# EAGLE design Bytes Turing Expander (EAGLE 6.5.0)
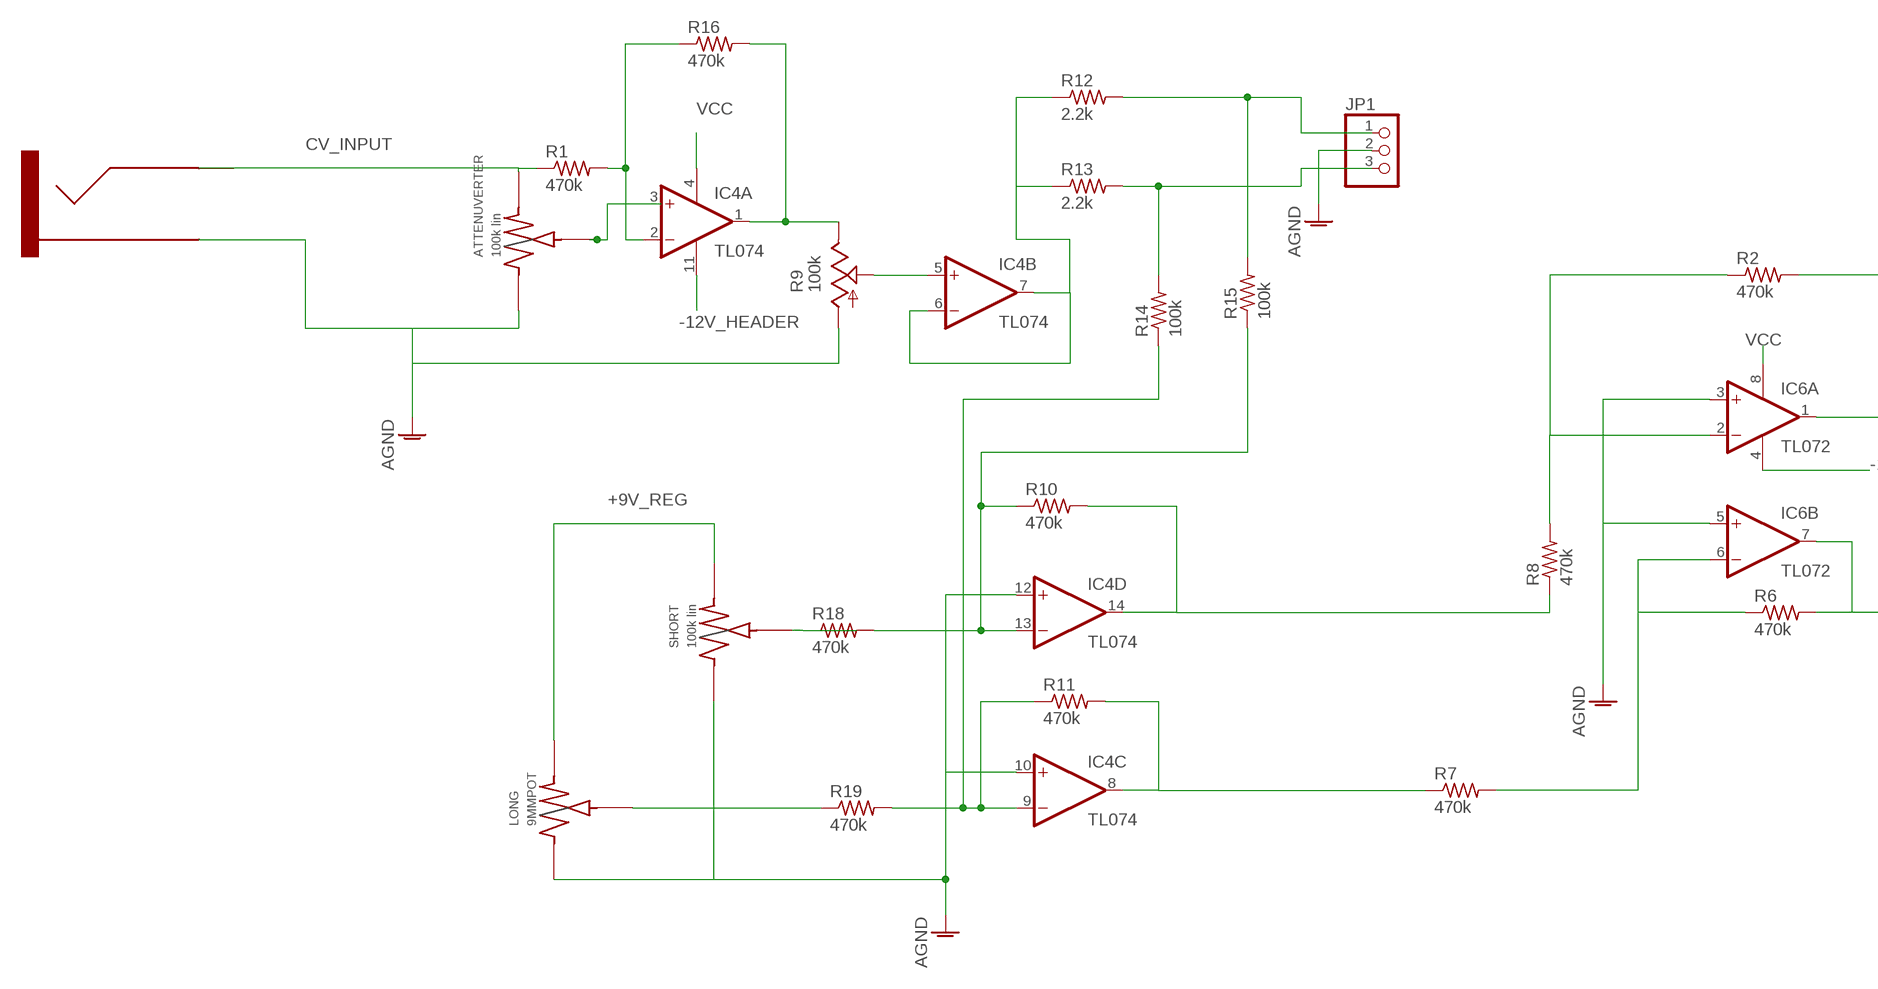
[diagram p0: schematic, sheet 1, part 1 of 2]
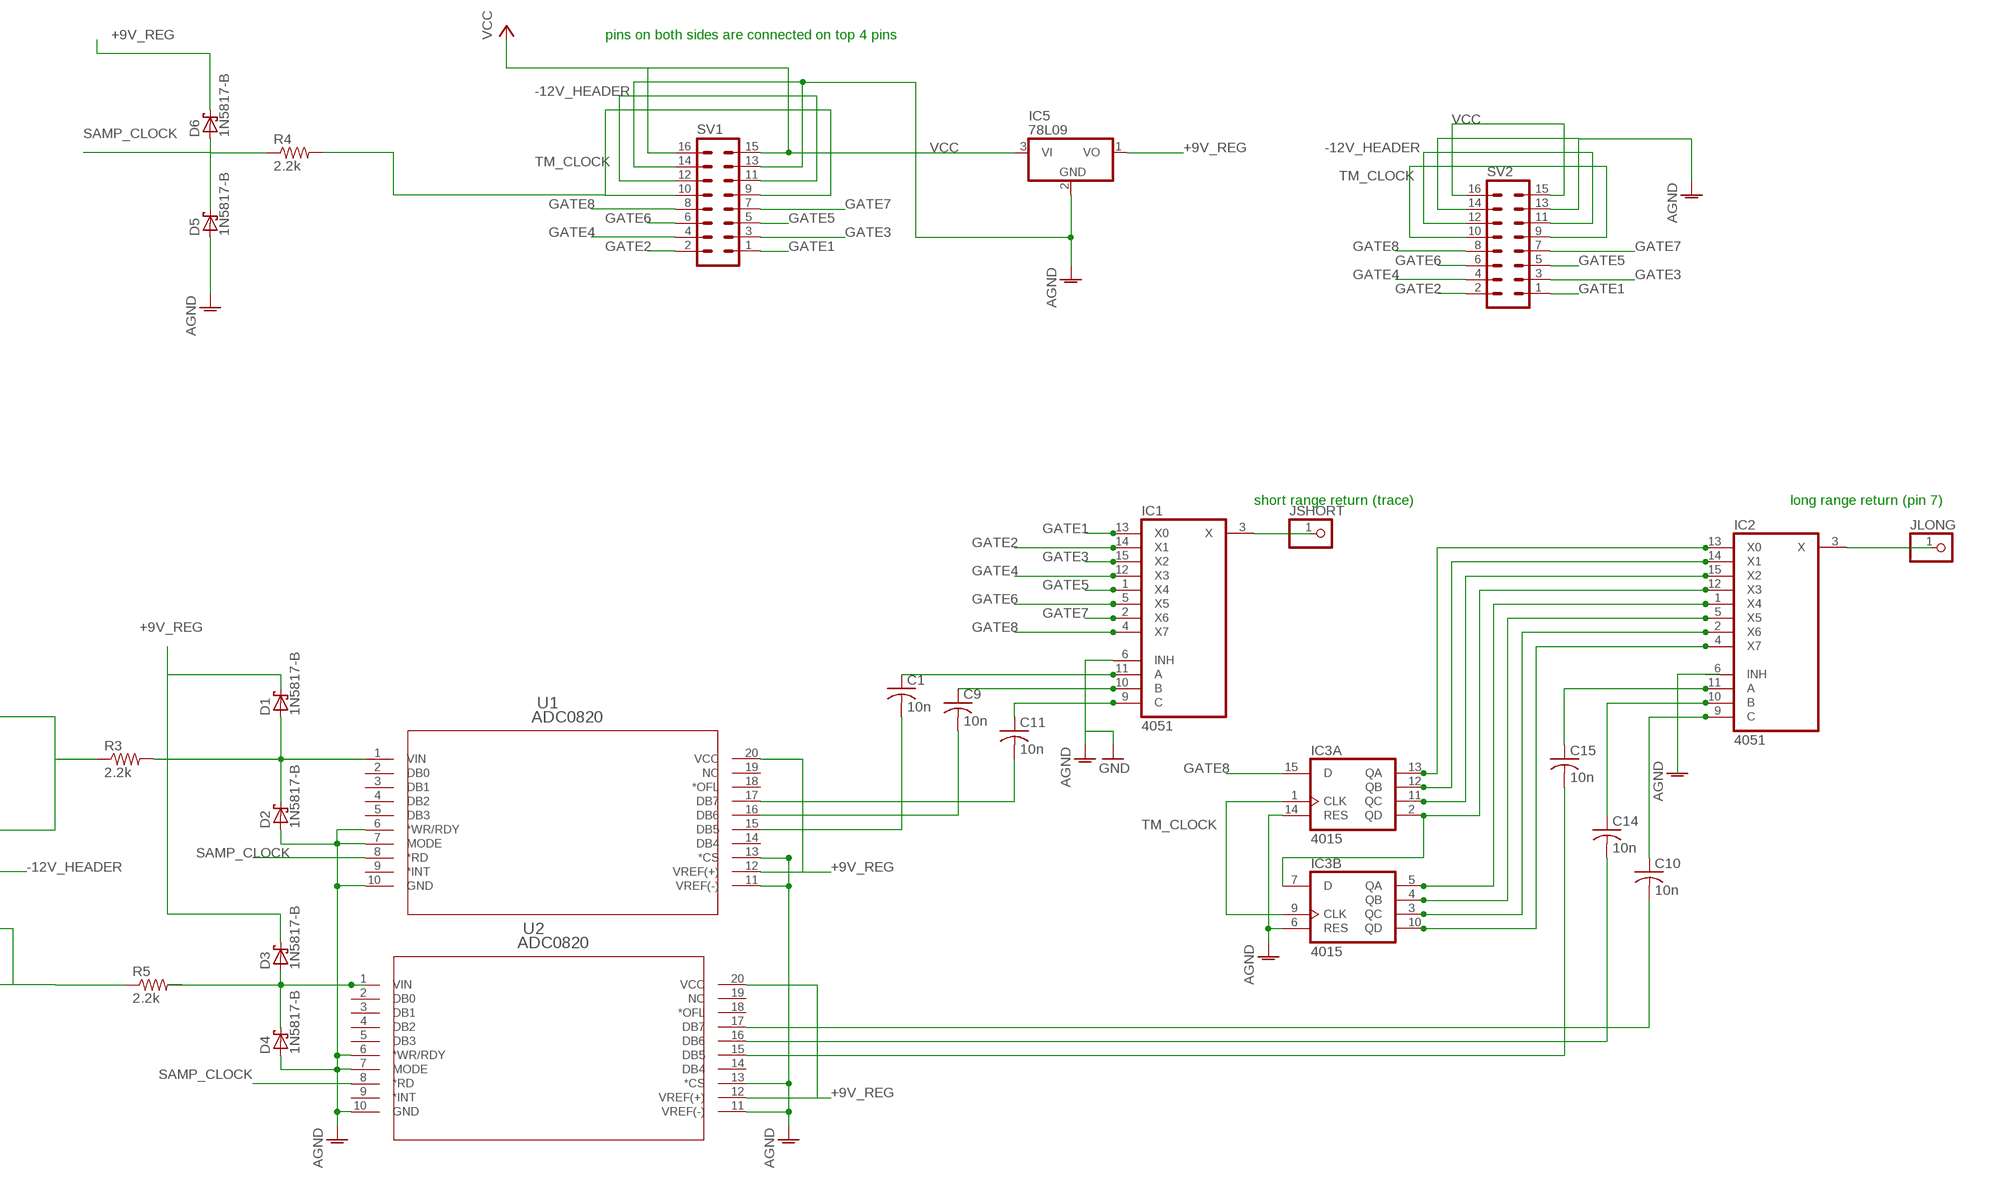
[diagram p1: schematic, sheet 1, part 2 of 2]

## Parts
ATTENUVERTER  100k lin  9MMPOT  [9MMPOT]
C1  10n  C-US025-024X044  [C025-024X044]
C9  10n  C-US025-024X044  [C025-024X044]
C10  10n  C-US025-024X044  [C025-024X044]
C11  10n  C-US025-024X044  [C025-024X044]
C14  10n  C-US025-024X044  [C025-024X044]
C15  10n  C-US025-024X044  [C025-024X044]
D1  1N5817-B  [DO41-7.6]
D2  1N5817-B  [DO41-7.6]
D3  1N5817-B  [DO41-7.6]
D4  1N5817-B  [DO41-7.6]
D5  1N5817-B  [DO41-7.6]
D6  1N5817-B  [DO41-7.6]
IC1  4051  4051N  [DIL16]
IC2  4051  4051N  [DIL16]
IC3  4015  4015N  [DIL16]
IC4  TL074  TL074P  [DIL14]
IC5  78L09  78L08Z  [TO92]
IC6  TL072  TL072P  [DIL08]
JLONG  PINHD-1X1  [1X01]
JP1  PINHD-1X3  [1X03]
JSHORT  PINHD-1X1  [1X01]
LONG  9MMPOT  [9MMPOT]
R1  470k  R-US_0204/2V  [0204V]
R2  470k  R-US_0204/2V  [0204V]
R3  2.2k  R-US_0204/2V  [0204V]
R4  2.2k  R-US_0204/2V  [0204V]
R5  2.2k  R-US_0204/2V  [0204V]
R6  470k  R-US_0204/2V  [0204V]
R7  470k  R-US_0204/2V  [0204V]
R8  470k  R-US_0204/2V  [0204V]
R9  100k  TRIM_US-B64Y  [B64Y]
R10  470k  R-US_0204/2V  [0204V]
R11  470k  R-US_0204/2V  [0204V]
R12  2.2k  R-US_0204/2V  [0204V]
R13  2.2k  R-US_0204/2V  [0204V]
R14  100k  R-US_0204/2V  [0204V]
R15  100k  R-US_0204/2V  [0204V]
R16  470k  R-US_0204/2V  [0204V]
R18  470k  R-US_0204/2V  [0204V]
R19  470k  R-US_0204/2V  [0204V]
SHORT  100k lin  9MMPOT  [9MMPOT]
SV1  MA08-2  [MA08-2]
SV2  MA08-2  [MA08-2]
U1  ADC0820  ADC0820-N_NFH_20  [NFH20]
U2  ADC0820  ADC0820-N_NFH_20  [NFH20]
U$1  3.5MMJACK  [3.5MMPHONEJACK]

## Nets
+9V_REG: D1.C D3.C D6.C IC5.1(VO) LONG.LEFT(RIGHT) SHORT.LEFT(RIGHT) U1.12(VREF(+)) U1.20(VCC) U2.12(VREF(+)) U2.20(VCC)
-12V_HEADER: IC4.11(P:V-) IC6.4(P:V-) SV1.11 SV1.12 SV2.11 SV2.12
AGND: ATTENUVERTER.RIGHT(LEFT) D2.A D4.A D5.A IC1.6(INH) IC3.6(B:RES) IC3.14(A:RES) IC4.10(C:+IN) IC4.12(D:+IN) IC5.2(GND) IC6.3(A:+IN) IC6.5(B:+IN) JP1.2 LONG.RIGHT(LEFT) R9.A SHORT.RIGHT(LEFT) SV1.13 SV1.14 SV2.13 SV2.14 U1.6(*WR/RDY) U1.7(MODE) U1.10(GND) U1.11(VREF(-)) U1.13(*CS) U2.6(*WR/RDY) U2.7(MODE) U2.10(GND) U2.11(VREF(-)) U2.13(*CS) U$1.SLEEVE ; supply symbol labelled GND
CV_INPUT: ATTENUVERTER.LEFT(RIGHT) R1.1 U$1.TIP
GATE1: IC1.13(X0) SV1.1 SV2.1
GATE2: IC1.14(X1) SV1.2 SV2.2
GATE3: IC1.15(X2) SV1.3 SV2.3
GATE4: IC1.12(X3) SV1.4 SV2.4
GATE5: IC1.1(X4) SV1.5 SV2.5
GATE6: IC1.5(X5) SV1.6 SV2.6
GATE7: IC1.2(X6) SV1.7 SV2.7
GATE8: IC1.4(X7) IC3.15(A:D) SV1.8 SV2.8
JSHORT: IC1.3(X) JSHORT.1
N$2: IC4.2(A:-IN) R1.2 R16.1
N$3: IC4.1(A:OUT) R9.E R16.2
N$4: LONG.CENTER R19.1
N$5: R18.1 SHORT.CENTER
N$6: IC4.6(B:-IN) IC4.7(B:OUT) R12.1 R13.1
N$7: IC4.5(B:+IN) R9.S
N$8: IC6.1(A:OUT) R2.2 R3.1
N$9: IC4.9(C:-IN) R11.1 R14.1 R19.2
N$10: IC2.12(X3) IC3.2(A:QD) IC3.7(B:D)
N$11: C11.1 IC1.9(C)
N$12: IC2.13(X0) IC3.13(A:QA)
N$13: IC2.14(X1) IC3.12(A:QB)
N$14: IC2.15(X2) IC3.11(A:QC)
N$15: IC2.1(X4) IC3.5(B:QA)
N$16: IC2.5(X5) IC3.4(B:QB)
N$17: IC2.2(X6) IC3.3(B:QC)
N$18: IC2.4(X7) IC3.10(B:QD)
N$19: IC4.14(D:OUT) R8.1 R10.2
N$20: IC6.7(B:OUT) R5.1 R6.2
N$21: IC4.8(C:OUT) R7.1 R11.2
N$22: JP1.3 R13.2 R14.2
N$23: C9.1 IC1.10(B)
N$24: C1.1 IC1.11(A)
N$25: C11.2 U1.17(DB7)
N$26: C9.2 U1.16(DB6)
N$27: C1.2 U1.15(DB5)
N$28: C10.1 IC2.9(C)
N$29: C15.1 IC2.11(A)
N$30: C14.1 IC2.10(B)
N$31: IC6.2(A:-IN) R2.1 R8.2
N$32: C15.2 U2.15(DB5)
N$33: C14.2 U2.16(DB6)
N$34: C10.2 U2.17(DB7)
N$35: JP1.1 R12.2 R15.2
N$36: ATTENUVERTER.CENTER IC4.3(A:+IN)
N$37: IC4.13(D:-IN) R10.1 R15.1 R18.2
N$39: IC6.6(B:-IN) R6.1 R7.2
N$47: IC2.3(X) JLONG.1
N$48: D3.A D4.C R5.2 U2.1(VIN)
N$49: D1.A D2.C R3.2 U1.1(VIN)
SAMP_CLOCK: D5.C D6.A R4.1 U1.8(*RD) U2.8(*RD)
TM_CLOCK: IC3.1(A:CLK) IC3.9(B:CLK) R4.2 SV1.9 SV1.10 SV2.9 SV2.10
VCC: IC4.4(P:V+) IC5.3(VI) IC6.8(P:V+) SV1.15 SV1.16 SV2.15 SV2.16
Unconnected: IC2.6(INH) U1.2(DB0) U1.3(DB1) U1.4(DB2) U1.5(DB3) U1.9(*INT) U1.14(DB4) U1.18(*OFL) U1.19(NC) U2.2(DB0) U2.3(DB1) U2.4(DB2) U2.5(DB3) U2.9(*INT) U2.14(DB4) U2.18(*OFL) U2.19(NC)

## Notes on the sheet
- pins on both sides are connected on top 4 pins
- short range return (trace) | long range return (pin 7)

## Power pins joined to a net without a drawn wire
AGND: IC1.7(VEE) IC1.8(GND) IC2.7(VEE) IC2.8(GND)
VCC: IC1.16(VCC) IC2.16(VCC) IC3.16(P:VDD)
VSS: IC3.8(P:VSS)

## Library data of the parts
ATTENUVERTER LONG SHORT = 9mmpot_modified:9MMPOT
C1 C9-C11 C14 C15 = resistor:C-US: CAPACITOR, American symbol
D1-D6 = diode:1N581*: 1.0A SCHOTTKY BARRIER RECTIFIER Source: http://www.diodes.com/datasheets/ds23001.pdf
IC1 IC2 = 40xx:4051: 8-channel ANALOG MULTIPLEXER
IC3 = 40xx:4015: Dual 4-bit static SHIFT REGISTER
IC4 = linear:TL074: OP AMP
IC5 = adafruit:78*: Positive VOLTAGE REGULATOR Added bigger pads to the TO-92 package
IC6 = linear:TL072: OP AMP
JLONG JSHORT = pinhead:PINHD-1X1: PIN HEADER
JP1 = adafruit:PINHD-1X3: PIN HEADER
R1-R8 R10-R16 R18 R19 = resistor:R-US_: RESISTOR, American symbol
R9 = pot:TRIM_US-: POTENTIOMETER
SV1 SV2 = con-lstb:MA08-2: PIN HEADER; OC_FARNELL: unknown; OC_NEWARK: unknown
U1 U2 = adc0820:ADC0820-N_NFH_20; MANUFACTURER_PART_NUMBER: adc0820_dw_20; VENDOR: Texas Instruments
U$1 = elipech_modified:3.5MMJACK

## Board
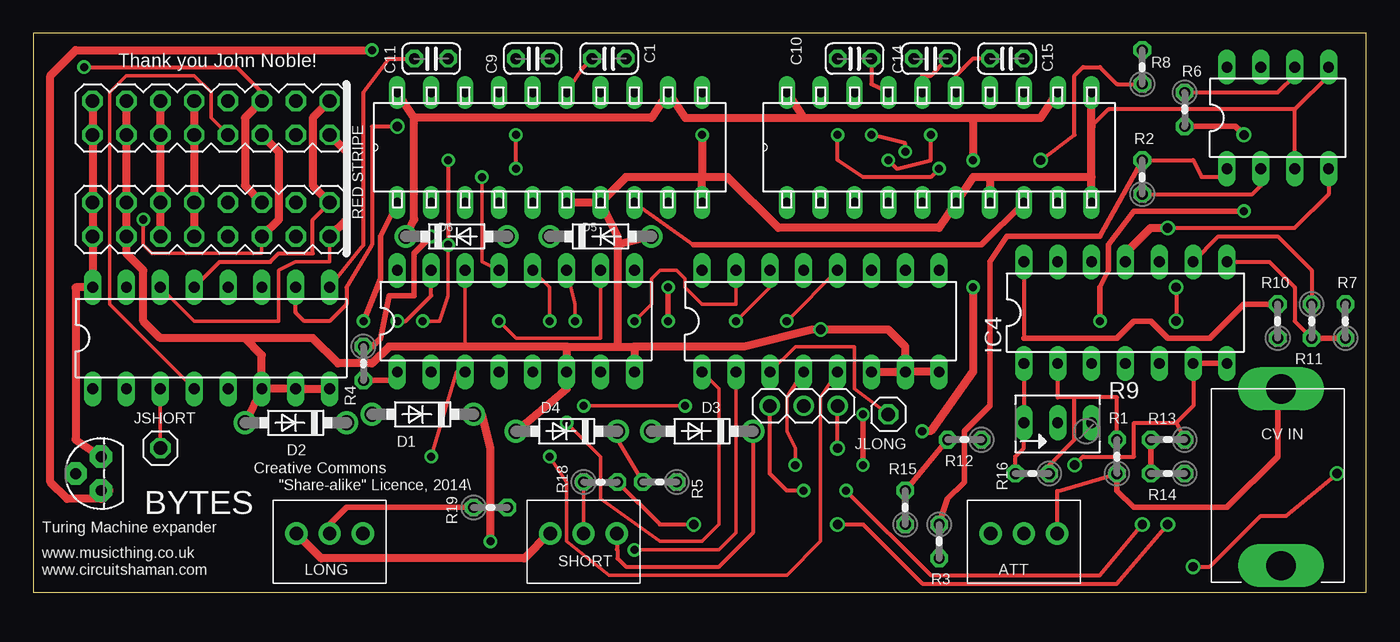
[diagram p2: board, top side]
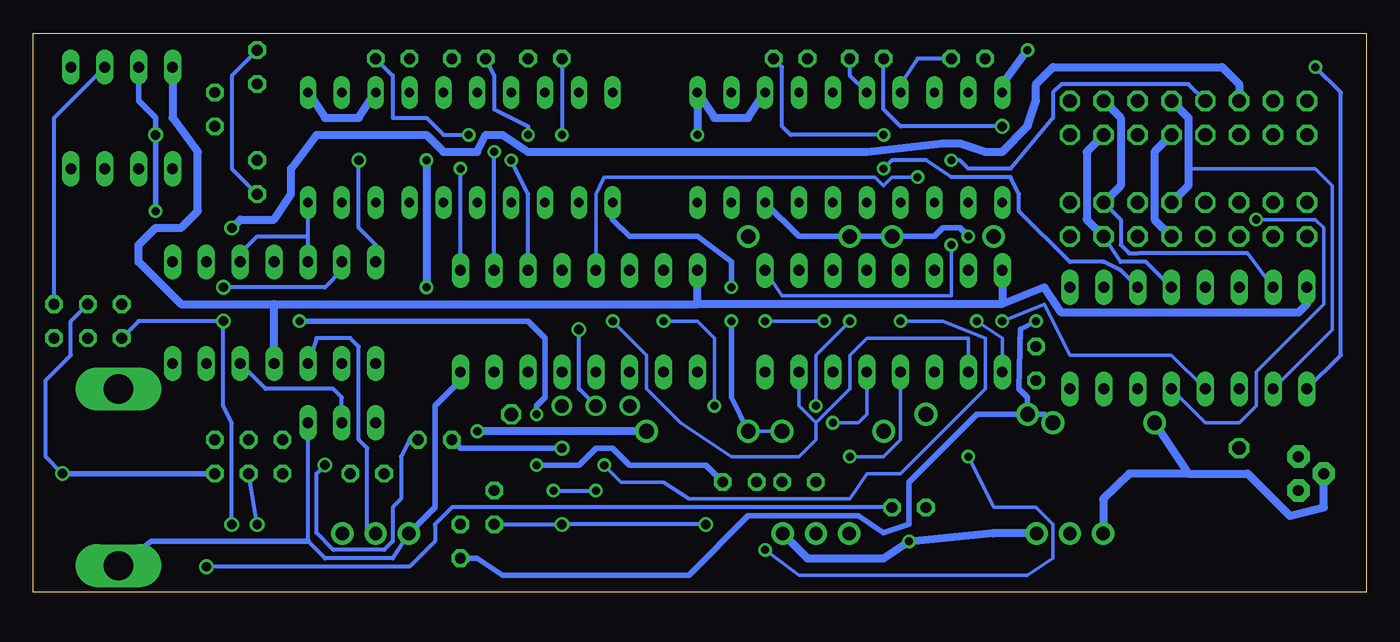
[diagram p3: board, bottom side, seen from below]

Size 99.97 x 41.9 mm. Coordinates in mm from the lower left corner, seen from the top.
Outline: 0,0 99.97,0 99.97,41.9 0,41.9 0,0
Copper layers (1*16): Top 0.035mm / dielectric 1.5mm / Bottom 0.035mm
Design rules "default *": minimum track width 10mil, minimum drill 24mil, track to track 8mil, track to pad 8mil, pad to pad 8mil, via to via 8mil, smd to smd 8mil, copper to edge 40mil, drill to drill 8mil, minimum pad ring 10mil, minimum via ring 8mil, stop-mask expansion 4mil, vias tented up to drill 1mm, thermal gap 10mil

### Footprints (pad centres in the part's own frame; a part is rotated, then mirrored left to right if it is on the bottom)
9MMPOT = drill 1 pad 1.676: CENTER -2.5,0; LEFT -2.5,2.5; RIGHT -2.5,-2.5
C025-024X044 = drill 0.813 octagon: 1 -1.27,0; 2 1.27,0
DO41-7.6 = drill 1.1 pad 1.7: A 3.81,0; C -3.81,0
DIL16 = drill 0.813 long: 1 -8.89,-3.81; 2 -6.35,-3.81; 3 -3.81,-3.81; 4 -1.27,-3.81; 5 1.27,-3.81; 6 3.81,-3.81; 7 6.35,-3.81; 8 8.89,-3.81; 9 8.89,3.81; 10 6.35,3.81; 11 3.81,3.81; 12 1.27,3.81; 13 -1.27,3.81; 14 -3.81,3.81; 15 -6.35,3.81; 16 -8.89,3.81
DIL14 = drill 0.813 long: 1 -7.62,-3.81; 2 -5.08,-3.81; 3 -2.54,-3.81; 4 0,-3.81; 5 2.54,-3.81; 6 5.08,-3.81; 7 7.62,-3.81; 8 7.62,3.81; 9 5.08,3.81; 10 2.54,3.81; 11 0,3.81; 12 -2.54,3.81; 13 -5.08,3.81; 14 -7.62,3.81
TO92 = drill 0.813 pad 1.676 octagon: 1 -1.27,0; 2 0,1.905; 3 1.27,0
DIL08 = drill 0.813 pad 1.27 long: 1 -3.81,-3.81; 2 -1.27,-3.81; 3 1.27,-3.81; 4 3.81,-3.81; 5 3.81,3.81; 6 1.27,3.81; 7 -1.27,3.81; 8 -3.81,3.81
1X01 = drill 1.016 octagon: 1 0,0
1X03 = drill 1.016: 1 -2.54,0; 2 0,0; 3 2.54,0
0204V = drill 0.813 octagon: 1 -1.27,0; 2 1.27,0
B64Y = drill 0.813 long: A 2.54,0; E -2.54,0; S 0,0
MA08-2 = drill 1.016 octagon: 1 -8.89,-1.27; 2 -8.89,1.27; 3 -6.35,-1.27; 4 -6.35,1.27; 5 -3.81,-1.27; 6 -3.81,1.27; 7 -1.27,-1.27; 8 -1.27,1.27; 9 1.27,-1.27; 10 1.27,1.27; 11 3.81,-1.27; 12 3.81,1.27; 13 6.35,-1.27; 14 6.35,1.27; 15 8.89,-1.27; 16 8.89,1.27
NFH20 = drill 0.711 long: 1 -8.255,22.86; 2 -8.255,20.32; 3 -8.255,17.78; 4 -8.255,15.24; 5 -8.255,12.7; 6 -8.255,10.16; 7 -8.255,7.62; 8 -8.255,5.08; 9 -8.255,2.54; 10 -8.255,0; 11 0,0; 12 0,2.54; 13 0,5.08; 14 0,7.62; 15 0,10.16; 16 0,12.7; 17 0,15.24; 18 0,17.78; 19 0,20.32; 20 0,22.86
3.5MMPHONEJACK = drill 2.2 pad 2.54 long: SLEEVE -5,-0.25; TIP 8.25,-0.25

### Placement (x,y rotation side)
ATTENUVERTER  74.3,1.91 270 top
C1  43.18,40 180 top
C9  37.46,40 0 top
C10  61.59,40 0 top
C11  29.85,40 0 top
C14  67.31,40 0 top
C15  73.03,40 180 top
D1  29.21,13.34 180 top
D2  19.69,12.7 180 top
D3  50.16,12.06 180 top
D4  40,12.06 180 top
D5  42.54,26.67 0 top
D6  31.75,26.67 0 top
IC1  13.33,19.05 0 top
IC2  59.05,20.32 0 top
IC3  36.2,20.32 0 top
IC4  81.92,20.95 0 top
IC5  5.08,8.89 90 top
IC6  93.34,35.56 0 top
JLONG  64.14,13.34 0 top
JP1  57.78,13.97 180 top
JSHORT  9.53,10.8 0 top
LONG  22.23,1.91 270 top
R1  81.28,10.16 90 top
R2  83.19,31.11 90 top
R3  67.95,3.81 270 top
R4  24.77,17.14 270 top
R5  46.99,8.26 180 top
R6  86.36,36.19 270 top
R7  98.43,20.32 90 top
R8  83.19,39.37 90 top
R9  76.84,12.7 0 top
R10  93.34,20.32 90 top
R11  95.89,20.32 270 top
R12  69.85,11.43 180 top
R13  85.09,11.43 180 top
R14  85.09,8.89 180 top
R15  65.41,6.35 90 top
R16  74.93,8.89 180 top
R18  42.54,8.26 0 top
R19  34.29,6.35 0 top
SHORT  41.27,1.91 270 top
SV1  13.33,35.56 180 top
SV2  13.33,27.94 180 top
U1  50.16,37.47 90 top
U2  79.38,37.47 90 top
U$1  93.34,6.98 90 top

### Tracks (layer width: path | path; a pad name or v marks a point on that pad's centre or on a via)
+9V_REG  (via drill 0.6, 0.61)
  Top 0.305: D3.C 53.98,4.45 51.43,1.91 44.45,1.91 43.81,2.54 43.81,3.17 43.77,3.21 SHORT.LEFT
  Top 0.61: IC5.1 5.71,7.62 5.08,6.98 2.54,6.98 1.27,8.26 1.27,38.73 3.17,40.64 v25.4,40.64 | U2.20 57.78,35.56 | 57.78,35.56 70.48,35.56 | 70.48,35.56 75.57,35.56 U2.12 | 57.78,35.56 48.89,35.56 U1.12 46.35,35.56 28.58,35.56 | v34.29,3.81 34.29,10.8 33.66,13.34 D1.C | v66.68,12.06 67.31,12.06 70.48,16.51 v70.48,22.86 | 70.48,35.56 v70.48,32.39 | 28.58,35.56 U1.20 | D6.C 28.58,27.94 28.58,35.56
  Bottom 0.61: v70.48,32.39 v70.48,22.86 | D3.C v66.68,12.06 | v25.4,40.64 27.31,38.1 U1.20 | LONG.LEFT 27.94,4.41 27.94,4.45 v34.29,3.81 36.2,2.54 41.91,2.54 SHORT.LEFT
-12V_HEADER  (via drill 0.7)
  Top 0.305: v85.09,27.3 94.62,27.3 97.16,29.84 IC6.4
  Top 0.61: SV1.11 SV1.12 SV2.11 SV2.12 | IC4.11 81.92,25.4 83.82,27.3 v85.09,27.3
  Bottom 0.61: SV1.11 9.53,38.1 10.79,39.37 23.5,39.37 24.77,38.1 24.77,36.83 25.4,34.92 27.31,33.02 28.58,33.02 30.48,33.66 31.75,33.66 37.46,33.02 62.86,33.02 64.77,34.29 66.04,34.29 66.68,33.02 69.22,33.02 70.48,34.29 78.74,34.29 80.65,31.75 80.65,29.84 81.92,27.94 84.45,27.94 v85.09,27.3
AGND  (via drill 0.6, 0.7)
  Top 0.254: 32.38,18.41 IC3.14
  Top 0.305: 94.62,36.19 80.65,36.19 79.38,34.92 | IC6.5 97.16,38.73 94.62,36.19 | IC6.3 94.62,36.19
  Top 0.61: SV1.13 SV1.14 SV2.13 SV2.14 6.98,25.4 8.26,24.13 8.26,20.32 9.53,19.05 15.88,19.05 | IC1.6 17.15,17.78 15.88,19.05 | IC1.6 D2.A | 40,18.41 32.38,18.41 26.67,18.41 25.4,17.14 22.86,17.14 20.96,19.05 15.88,19.05 | D4.A 40,15.24 IC3.6 40,18.41 | 40,18.41 43.81,18.41 | 43.81,18.41 45.09,18.41 | 45.09,18.41 45.09,16.51 | U1.7 43.81,26.67 43.81,26.03 | 43.81,26.03 43.81,18.41 | U1.7 U1.6 | U1.10 50.16,31.11 | 50.16,31.11 44.45,31.11 U1.7 | U2.10 79.38,31.11 | 79.38,31.11 71.76,31.11 | 71.76,31.11 U2.7 | v50.16,34.29 50.16,31.11 | 71.76,31.11 70.48,31.11 U2.6 67.95,27.3 55.88,27.3 52.07,31.11 50.16,31.11 | IC2.8 IC2.7 | IC1.6 IC1.7 IC1.8 | IC2.7 65.41,18.41 64.14,19.69 v59.05,19.69 58.42,19.69 53.34,18.41 45.09,18.41 | D5.A 43.81,26.03 | 79.38,31.11 79.38,34.92 U2.11 | 62.86,16.51 IC2.7 | SHORT.RIGHT 38.7,4.41 36.83,2.54 21.59,2.54 LONG.RIGHT
  Bottom 0.305: ATTENUVERTER.RIGHT 73.03,2.54 78.11,2.54 79.38,3.81 R9.A | IC4.12 79.38,26.67 | 79.38,26.67 U2.10 | JP1.2 59.05,15.24 v59.05,19.69 | IC4.10 84.45,25.4 83.19,26.67 79.38,26.67
  Bottom 0.406: IC2.8 67.95,15.88 69.85,13.97 69.85,6.35 ATTENUVERTER.RIGHT | 79.38,3.81 91.14,3.81 U$1.SLEEVE
  Bottom 0.61: D2.A 13.33,8.89 | 13.33,8.89 8.89,8.89 5.71,5.71 3.17,6.35 IC5.2 | U2.11 78.11,35.56 75.57,35.56 U2.13 | U1.13 46.35,35.56 48.89,35.56 U1.11 v50.16,34.29 | 13.33,8.89 17.78,8.89 19.73,6.98 LONG.RIGHT
CV_INPUT
  Top 0.305: ATTENUVERTER.LEFT 76.8,7.58 R1.1
  Top 0.406: R1.1 81.28,7.62 82.55,6.35 89.54,6.35 93.34,10.16 93.34,14.98 U$1.TIP
GATE1
  Top 0.305: IC1.13 13.97,24.77 17.78,24.77 18.42,25.4 20.96,25.4 20.96,27.94 SV2.1
  Top 0.61: SV1.1 20.96,35.56 20.96,30.48 SV2.1
GATE2
  Top 0.254: IC1.14 12.06,20.32 18.42,20.32 18.42,24.13 19.69,24.77 22.23,24.77 SV2.2
  Top 0.61: SV1.2 23.5,33.02 23.5,27.94 SV2.2
GATE3
  Bottom 0.305: IC1.15 8.89,25.4 17.15,25.4 17.78,25.4 18.42,26.03 18.42,27.94 SV2.3
  Bottom 0.61: SV1.3 18.42,35.56 18.42,30.48 SV2.3
GATE4
  Bottom 0.305: IC1.12 16.51,24.77 18.42,24.77 SV2.4
  Bottom 0.61: SV1.4 20.96,33.02 20.96,27.94 SV2.4
GATE5  (via drill 0.6)
  Top 0.305: v3.81,39.37 15.24,39.37 17.15,37.47 SV1.5
  Top 0.61: SV1.5 15.88,35.56 15.88,30.48 SV2.5
  Bottom 0.305: IC1.1 1.91,17.78 1.91,37.47 v3.81,39.37
GATE6  (via drill 0.61)
  Top 0.254: v8.26,27.94 8.26,26.03 8.89,25.4 17.15,25.4 SV2.6
  Top 0.61: SV1.6 18.42,33.02 18.42,27.94 SV2.6
  Bottom 0.254: IC1.5 12.06,12.7 9.53,12.7 8.26,13.97 8.26,16.51 3.17,21.59 3.17,27.3 3.81,27.94 v8.26,27.94
GATE7
  Bottom 0.254: IC1.2 2.54,19.69 2.54,30.48 3.81,31.75 13.33,31.75
  Bottom 0.61: SV1.7 13.33,35.56 13.33,31.75 13.33,30.48 SV2.7
GATE8  (via drill 0.61)
  Top 0.254: IC1.4 5.71,21.59 5.71,37.47 6.98,38.73 12.06,38.73 13.33,37.47 13.33,35.56 SV1.8
  Top 0.305: v27.31,20.32 27.94,20.32 29.85,22.23 IC3.15
  Bottom 0.254: v27.31,20.32 24.13,21.59 22.23,17.78 14.61,17.78 IC1.4
  Bottom 0.61: SV1.8 15.88,33.02 15.88,27.94 SV2.8
JSHORT
  Top 0.254: JSHORT.1 IC1.3
N$1  (via drill 0.6)
  other vias: 62.86,34.29
N$2
  Top 0.305: R1.2 81.28,14.6 78.11,14.6 | 78.11,14.6 76.84,14.6 IC4.2 | R16.1 76.2,9.52 78.11,11.43 78.11,14.6
N$3
  Top 0.305: IC4.1 R9.E 74.3,10.8 73.66,10.16 R16.2
N$4
  Top 0.406: LONG.CENTER 22.23,5.08 23.5,6.35 R19.1
N$5
  Top 0.254: R18.1 SHORT.CENTER
N$6  (via drill 0.7)
  Top 0.305: v78.11,9.52 78.74,10.16 82.55,10.16 82.55,12.7 85.73,12.7 | 85.73,12.7 R13.1 | IC4.6 87,13.97 85.73,12.7
  Top 0.406: IC4.6 IC4.7
  Bottom 0.305: R12.1 71.76,11.43 72.39,10.16 72.39,6.98 73.03,6.35 73.03,3.81 73.66,3.17 77.47,3.17 78.74,4.45 78.74,8.89 v78.11,9.52
N$7
  Bottom 0.305: R9.S 76.84,14.6 77.47,15.24 82.55,15.24 IC4.5
N$8
  Top 0.305: R2.2 87,32.39 87.63,31.11 89.54,31.11 IC6.1
  Top 0.406: R2.2 80.01,26.67 73.03,26.67 71.76,24.77 71.76,13.97 69.85,12.06 69.85,8.26 68.58,6.98 R3.1
N$9  (via drill 0.7)
  Top 0.305: IC4.9 88.9,26.67 93.34,26.67 95.89,24.13 R11.1 | v87,1.91 88.27,1.91 92.08,5.71 93.98,5.71 v97.79,8.89
  Bottom 0.305: R19.2 68.58,6.35 69.85,5.08 69.85,3.81 71.76,1.91 v87,1.91 | v97.79,8.89 99.06,10.16 99.06,15.88 97.16,17.78 97.16,20.32 R11.1
  Bottom 0.406: R14.1 v97.79,8.89
N$10  (via drill 0.61)
  Top 0.254: v56.52,20.32 IC2.12
  Bottom 0.254: IC3.2 29.85,19.05 37.46,19.05 38.73,17.78 38.73,15.24 41.27,12.7 | 41.27,12.7 42.54,13.97 IC3.7 | v56.52,20.32 53.98,17.78 53.98,15.24 51.43,12.7 47.62,10.16 42.54,10.16 41.27,11.43 41.27,12.7
N$11
  Top 0.305: IC1.9 24.77,26.03 24.77,37.47 26.67,40 C11.1
N$12  (via drill 0.61)
  Top 0.254: IC3.13 33.66,24.77 v33.66,31.11
  Bottom 0.254: v33.66,31.11 35.56,31.11 36.2,30.48 36.83,31.11 57.15,31.11 57.78,29.84 IC2.13
N$13  (via drill 0.61)
  Top 0.254: IC3.12 38.73,22.86 v38.73,20.32 | v48.89,13.97 v41.27,13.97 | v52.7,20.32 55.24,22.86 IC2.14
  Bottom 0.254: v38.73,20.32 41.27,17.78 v41.27,13.97 | v48.89,13.97 48.89,19.05 50.16,20.32 v52.7,20.32
N$14  (via drill 0.61)
  Top 0.254: IC3.11 40.64,21.59 v40.64,20.32 | v45.09,20.32 46.35,21.59 46.35,23.5 46.99,24.13 48.26,24.13 48.89,23.5 48.89,22.86 50.16,21.59 52.7,21.59 IC2.15
  Bottom 0.254: v45.09,20.32 v40.64,20.32
N$15  (via drill 0.61)
  Top 0.254: v40,12.7 42.54,10.16 42.54,6.98 46.99,3.81 50.16,3.81 51.43,5.08 51.43,15.24 IC2.1
  Bottom 0.254: IC3.5 37.46,13.34 38.1,12.7 v40,12.7
N$16  (via drill 0.61)
  Top 0.254: v38.73,10.16 40,8.26 40,3.81 43.18,1.27 56.52,1.27 59.05,3.81 59.05,14.6 IC2.5
  Bottom 0.254: IC3.4 34.92,11.43 36.2,10.16 v38.73,10.16
N$17  (via drill 0.61)
  Top 0.254: IC3.3 31.75,16.51 v29.85,10.16 | v45.09,3.17 51.43,3.17 52.7,4.45 IC2.2
  Bottom 0.254: v29.85,10.16 27.94,6.35 24.77,6.35 23.5,5.08 23.5,2.54 25.4,1.27 42.54,1.27 v45.09,3.17
N$18  (via drill 0.61)
  Top 0.254: v57.15,9.52 57.15,10.8 56.52,12.06 56.52,14.6 IC2.4 | v34.92,20.32 36.2,19.05 42.54,19.05 IC3.10
  Bottom 0.254: v57.15,9.52 55.88,8.26 52.7,8.26 50.8,6.98 38.73,6.98 37.46,8.89 34.92,8.89 28.58,15.24 28.58,19.05 31.75,20.32 v34.92,20.32
N$19  (via drill 0.7)
  Top 0.305: v75.57,32.39 78.11,34.29 78.11,38.73 78.74,39.37 80.01,39.37 81.28,38.1 R8.1 | IC4.14 74.3,19.05
  Top 0.406: R10.2 90.81,21.59 88.27,19.05 85.09,19.05 83.82,20.32 82.55,20.32 81.28,19.05 74.3,19.05
  Bottom 0.305: IC4.14 74.3,26.03 75.57,27.3 v75.57,32.39
N$20  (via drill 0.6, 0.7)
  Top 0.406: v62.23,9.52 v62.23,13.34 | v80.01,20.32 80.01,22.86 80.65,24.13 80.65,26.03 82.55,28.58 v90.81,28.58 | R6.2 90.17,34.92 v90.81,34.29
  Bottom 0.406: R5.1 49.53,9.52 55.24,9.52 56.52,10.8 57.78,10.8 59.05,9.52 v62.23,9.52 | v62.23,13.34 62.23,13.97 61.59,14.6 61.59,19.05 62.86,20.32 v80.01,20.32 | IC6.7 92.08,36.83 90.81,35.56 v90.81,34.29 v90.81,28.58
N$21
  Top 0.305: R11.2 94.62,20.32 94.62,22.86 92.71,24.77 IC4.8
  Top 0.406: R7.1 R11.2
N$22  (via drill 0.6, 0.7)
  Top 0.305: v60.96,7.62 67.31,1.27 80.01,1.27 v83.19,5.08 | v57.78,7.62 56.52,7.62 55.24,8.89 JP1.3
  Top 0.406: R13.2 R14.2
  Bottom 0.305: v83.19,5.08 R14.2 | v60.96,7.62 v57.78,7.62
N$23  (via drill 0.7)
  Top 0.305: IC1.10 19.69,20.95 20.32,20.32 22.23,20.32 23.5,21.59 23.5,22.86 25.4,26.03 25.4,34.92 v27.31,34.92
  Bottom 0.305: v27.31,34.92 34.92,34.92 36.2,36.19 C9.1
N$24  (via drill 0.6)
  Top 0.305: v36.2,31.75 v36.2,34.29
  Bottom 0.305: IC1.11 18.42,24.13 19.69,24.77 22.23,24.77 26.04,28.58 26.04,29.84 26.67,31.11 31.12,31.11 33.02,32.39 35.56,32.39 v36.2,31.75 | v36.2,34.29 43.18,34.29 43.81,34.92 43.81,39.37 C1.1
N$25
  Bottom 0.305: C11.2 33.66,40 34.92,38.1 U1.17
N$26
  Bottom 0.305: U1.16 38.73,38.73 C9.2
N$27
  Top 0.305: U1.15 41.27,39.37 C1.2
N$28  (via drill 0.6)
  Top 0.305: v67.95,31.75 67.31,31.11 62.23,31.11 60.32,32.39 v60.32,34.29
  Bottom 0.305: IC2.9 v67.95,31.75 | C10.1 v60.32,34.29
N$29  (via drill 0.6)
  Top 0.305: v64.14,32.39 64.77,31.75 67.31,32.39 v67.31,34.29
  Bottom 0.305: IC2.11 62.86,29.84 v64.14,32.39 | C15.1 73.03,38.73 73.03,35.56 70.48,35.56 69.22,34.29 v67.31,34.29
N$30  (via drill 0.6)  (1 unrouted)
  Top 0.305: v65.41,33.02 65.41,33.66 62.86,34.29
  Bottom 0.305: IC2.10 v65.41,33.02 | C14.1 65.41,38.73 65.41,36.19 62.86,34.92 62.86,34.29
N$31
  Top 0.305: R2.1 91.44,29.84 92.08,30.48 IC6.2
  Bottom 0.305: R8.2 85.09,38.73 85.09,31.75 R2.1
N$32
  Top 0.305: C15.2 70.48,40 69.22,38.73 U2.15
N$33
  Top 0.305: U2.16 66.68,38.73 67.31,38.73 C14.2
N$34
  Top 0.305: C10.2 62.86,38.1 U2.17
N$35  (via drill 0.7)
  Top 0.305: v60.32,10.8 JP1.1
  Top 0.406: R12.2 R15.2
  Bottom 0.406: R12.2 67.95,10.8 v60.32,10.8
N$36
  Bottom 0.305: ATTENUVERTER.CENTER 74.93,4.41 74.93,10.8 75.57,11.43 75.57,18.41 76.2,19.05 78.74,19.05 IC4.3
N$37  (via drill 0.7)
  Top 0.305: v85.73,22.86 v85.73,20.32 | R18.2 46.99,5.08 v49.53,5.08 | v60.32,5.08 62.23,5.08 66.68,0.63 81.28,0.63 v85.09,5.08
  Bottom 0.305: IC4.13 76.84,24.13 78.11,22.86 v85.73,22.86 | R10.1 92.08,20.32 v85.73,20.32 85.73,13.97 85.09,12.7 v85.09,5.08 | v49.53,5.08 v60.32,5.08 R15.1
N$39
  Top 0.305: R6.1 93.34,37.47 94.62,38.73 IC6.6
  Bottom 0.305: R7.2 98.43,35.56 IC6.6
N$47
  Top 0.254: IC2.3 57.15,18.41 61.59,18.41 61.59,15.24 JLONG.1
N$48  (via drill 0.6)
  Top 0.254: R5.2 43.81,11.43 D4.C
  Top 0.406: v47.62,20.32 v47.62,22.86
  Bottom 0.254: D3.A D4.C
  Bottom 0.406: D3.A 47.62,14.6 v47.62,20.32 | v47.62,22.86 47.62,24.77 50.16,26.67 55.24,26.67 56.52,27.94 U2.1
N$49  (via drill 0.6)
  Top 0.406: v24.77,20.32 26.04,23.5 26.04,26.67 U1.1
  Bottom 0.254: 26.04,19.05 25.92,19.7
  Bottom 0.406: D1.A 25.4,14.6 26.04,15.24 25.92,19.7 v24.77,20.32 | D2.C 24.13,13.34 D1.A | D1.A 29.21,13.34 34.29,8.26 34.29,5.08 36.2,4.45 38.1,5.71 46.35,5.71 50.8,1.27 64.77,1.27 66.68,2.54 R3.2
SAMP_CLOCK  (via drill 0.6)
  Top 0.305: U1.8 49.53,26.03
  Top 0.406: U2.8 71.12,26.03 49.53,26.03 | R4.1 25.4,18.41 26.04,19.05 26.67,22.23 28.58,22.23 28.58,25.4 v29.85,26.67
  Bottom 0.406: v29.85,26.67 30.48,27.3 31.75,27.3 32.38,26.67 D6.A D5.C 42.54,26.67 U1.8
TM_CLOCK  (via drill 0.6, 0.61)
  Top 0.254: v31.12,26.03 31.12,22.23 30.48,20.32 v29.21,20.32
  Top 0.305: v31.12,32.39 v31.12,26.03
  Top 0.406: R4.2 26.67,15.88 IC3.1
  Top 0.61: SV1.9 SV1.10 SV2.9 SV2.10
  Bottom 0.254: IC3.1 27.31,19.05 v29.21,20.32 | v31.12,26.03 31.12,22.23 43.81,22.23 IC3.9
  Bottom 0.305: SV1.9 13.33,38.1 22.86,38.1 23.5,37.47 23.5,35.56 26.67,31.75 29.85,31.75 30.48,32.39 v31.12,32.39
VCC
  Top 0.61: SV1.15 SV1.16 SV2.15 SV2.16 IC1.16 3.17,22.86 3.17,11.43 IC5.3
  Bottom 0.61: IC1.16 4.45,21.59 5.08,20.95 22.86,20.95 24.13,22.86 27.31,21.59 | 27.31,21.59 50.16,21.59 | 50.16,21.59 IC2.16 | 81.92,21.59 88.9,21.59 92.08,24.77 92.08,26.03 90.81,27.3 88.9,27.3 87.63,28.58 87.63,33.02 89.54,35.56 IC6.8 | 81.92,21.59 50.16,21.59 | IC3.16 27.31,21.59 | IC4.4 81.92,21.59

### Text on the board
tNames: Thank you John Noble! | RED STRIPE | CV IN | Creative Commons | BYTES | "Share-alike" Licence, 2014\ | Turing Machine expander | www.musicthing.co.uk | SHORT | www.circuitshaman.com | LONG | ATT